# Altium schematic sheet DS134-1.0-B色度传感器partB.SchDoc
size A4
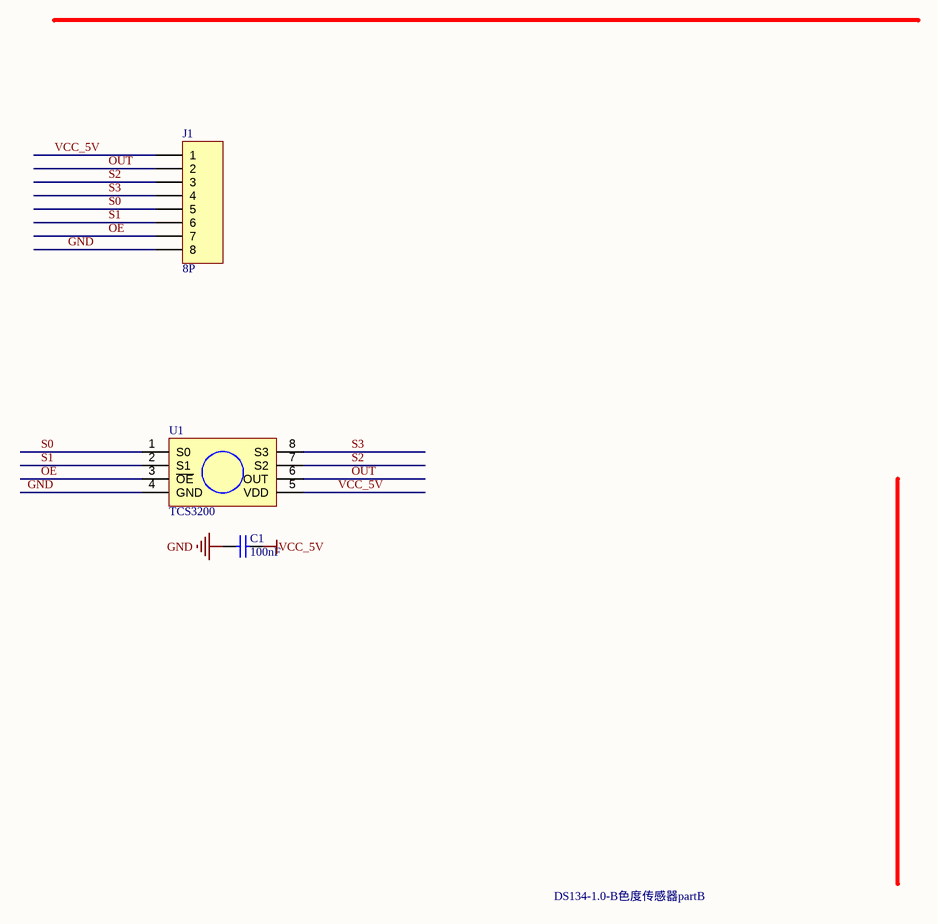
[diagram p0: DS134-1.0-B色度传感器partB.SchDoc]

## Parts
C1  value 100nF  [0805CAP]  (hidden comment: SMDCAP00014)
J1  value 8P  [SIP8]  (hidden comment: SL000000042)
U1  TCS3200  [SO-8]

## Nets
GND: C1.2 J1.8 U1.4(GND)
VCC_5V: C1.1 J1.1 U1.5(VDD)
OE: J1.7 U1.3(~{OE})
OUT: J1.2 U1.6(OUT)
S0: J1.5 U1.1(S0)
S1: J1.6 U1.2(S1)
S2: J1.3 U1.7(S2)
S3: J1.4 U1.8(S3)

## Notes on the sheet
- DS134-1.0-B色度传感器partB
- DWG. NO.
- REV.
- SHT.
- THIS DOCUMENT AND THE DATA DISCLOSED HEREIN OR HEREWITH IS THE PROPERTY OF ALTIUM LIMITED AND MAY BE FREELY DISTRIBUTED IN WHOLE. NO RIGHTS ARE RESERVED OR EXPRESS OR IMPLIED WARANTEE GIVEN.
- REVISION
- DESCRIPTION
- DATE
- APPROVED
- ENG:
- APPROVALS
- PROJECT
- DSN:
- CHK:
- REFERENCE DOCUMENTS
- PROJECT REVISION:
- TITLE
- DOCUMENT REVISION:
- DESIGN ITEM:
- BOM:
- FAB DWG:
- PCB DWG:
- ASSY DWG:
- SCALE:
- SIZE
- B
- CAGE CODE
- FILE NAME
- DWG NO.
- SHEET
- OF
- REV

## Library data of the parts
C1 = MLCC 100nF 50V ±10％ 0805: 贴片电容
J1 = DIP8 单排直针 1*40P 间距2.54mm 针长11mm 铜: 单排直针